# Altium schematic sheet MDL-485.SchDoc
size A4; DocumentNumber: 4; SheetNumber: 4
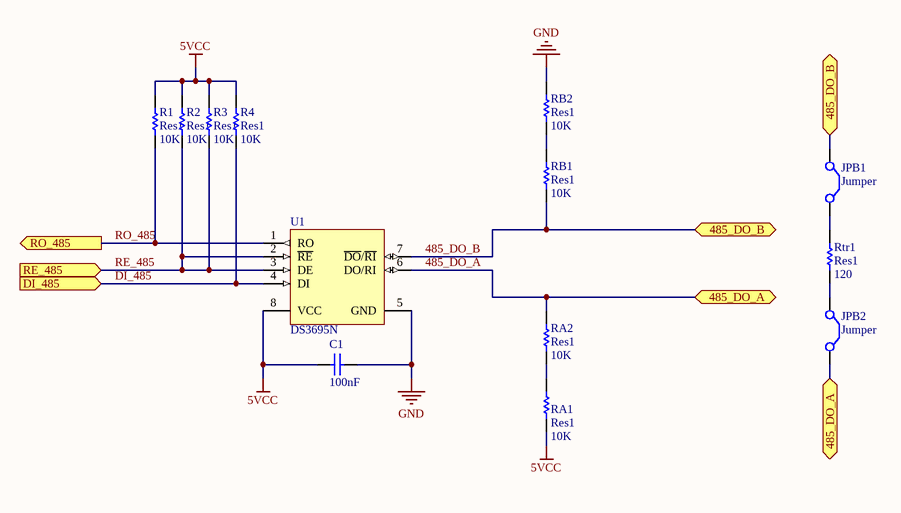
[diagram p0: MDL-485.SchDoc]

## Parts
C1  value 100nF  [VP44-2.5]  (hidden comment: VP44BY224JB)
JPB1  Jumper  [RAD-0.2]
JPB2  Jumper  [RAD-0.2]
R1  Res1  value 10K  [AXIAL-0.3]
R2  Res1  value 10K  [AXIAL-0.3]
R3  Res1  value 10K  [AXIAL-0.3]
R4  Res1  value 10K  [AXIAL-0.3]
RA1  Res1  value 10K  [AXIAL-0.3]
RA2  Res1  value 10K  [AXIAL-0.3]
RB1  Res1  value 10K  [AXIAL-0.3]
RB2  Res1  value 10K  [AXIAL-0.3]
Rtr1  Res1  value 120  [AXIAL-0.3]
U1  DS3695N  [N08E]

## Ports
485_DO_A (bidir), 485_DO_B (bidir), DI_485 (in), RE_485 (in), RO_485 (out)

## Nets
5VCC: C1.1 R1.2 R2.2 R3.2 R4.2 RA1.1 U1.8(VCC)
GND: C1.2 RB2.2 U1.5(GND)
485_DO_A: JPB2.2(C2) RA2.2 U1.6(DO/RI) ; port 485_DO_A
485_DO_B: JPB1.1(C1) RB1.1 U1.7(~{DO}/~{RI}) ; port 485_DO_B
DI_485: R4.1 U1.4(DI) ; port DI_485
RE_485: R2.1 R3.1 U1.2(~{RE}) U1.3(DE) ; port RE_485
RO_485: R1.1 U1.1(RO) ; port RO_485
NetJPB1_2: JPB1.2(C2) Rtr1.2
NetJPB2_1: JPB2.1(C1) Rtr1.1
NetRA1_2: RA1.2 RA2.1
NetRB1_2: RB1.2 RB2.1

## Library data of the parts
C1 = VP44BY224JB: Dipped Radial Multilayer Ceramic Capacitor X7R: 220nF, 100V; Published: 17-Dec-2003; DatasheetDocument: 4-Feb-2002; PackageDocument: 4-Feb-2002; PackageReference: VP44-2.5; Publisher: Altium Limited; ComponentLink1Description: Manufacturer Link; ComponentLink1URL: http://www.vishay.com/
JPB1 JPB2 = Jumper: Jumper Wire; Published: 24-Mar-1999; LatestRevisionDate: 17-Jul-2002; LatestRevisionNote: Re-released for DXP Platform.; PackageReference: RAD-0.2; Publisher: Altium Limited; PackageDescription: Radial Cap, Thru-Hole; 2 Leads; 0.2 in Pin Spacing
R1-R4 RA1 RA2 RB1 RB2 Rtr1 = Res1: Resistor; Published: 8-Jun-2000; LatestRevisionDate: 17-Jul-2002; LatestRevisionNote: Re-released for DXP Platform.; PackageReference: AXIAL-0.3; Publisher: Altium Limited; PackageDescription: Axial Device, Thru-Hole; 2 Leads; 0.3 in Pin Spacing
U1 = DS3695N: Multipoint RS485/RS422 Transceiver/Repeater; Manufacturer: National Semiconductor; CompType: Interface IC; PackageTopMarking: NSUZXYTT*DS3695N; PowerWise: N; Published: 4-Dec-2008; DatasheetVersion: May-1998; PackageVersion: revG, May-2006; PackageReference: N08E; Publisher: Altium Limited; PackageDescription: MDIP, .365 x .250 x .130in, 8 Lead, .100in Pitch; PartNumber: DS3695N; RoHS: O; PinCount: 8; DigiKeyPartNumber: DS3695N-ND; Code_JEDEC: MS-001-BA; ComponentLink1Description: DS3695 Datasheet; ComponentLink1URL: http://www.national.com/ds/DS/DS3695.pdf; ComponentLink2Description: DS3695 Web Page; ComponentLink2URL: http://www.national.com/pf/DS/DS3695.html; ComponentLink3Description: N08E Package Page; ComponentLink3URL: http://www.national.com/packaging/folders/n08e.html